# EAGLE design multiple_LED (EAGLE 7.3.0)
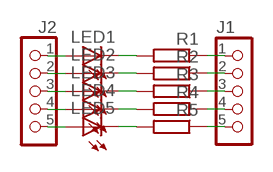
[diagram p0: schematic, sheet 1]

## Parts
J1  CON_HEADER_1X05-PTH  [M1X5]
J2  CON_HEADER_1X05-PTH  [M1X5]
LED1  LED-0805  [LED-805]
LED2  LED-0805  [LED-805]
LED3  LED-0805  [LED-805]
LED4  LED-0805  [LED-805]
LED5  LED-0805  [LED-805]
R1  RESISTOR-0603  [R603]
R2  RESISTOR-0603  [R603]
R3  RESISTOR-0603  [R603]
R4  RESISTOR-0603  [R603]
R5  RESISTOR-0603  [R603]

## Nets
IN: J2.1 LED1.A
IN1: J2.2 LED2.A
IN2: J2.3 LED3.A
IN3: J2.4 LED4.A
IN4: J2.5 LED5.A
N$1: LED2.C R2.2
N$2: LED1.C R1.2
N$3: LED3.C R3.2
N$4: LED4.C R4.2
N$5: LED5.C R5.2
OUT: J1.1 R1.1
OUT1: J1.2 R2.1
OUT2: J1.3 R3.1
OUT3: J1.4 R4.1
OUT4: J1.5 R5.1

## Library data of the parts
J1 J2 = dp_devices:CON_HEADER_1X05
LED1-LED5 = dp_devices:LED: Light Emitting Diode
R1-R5 = dp_devices:RESISTOR

## Board
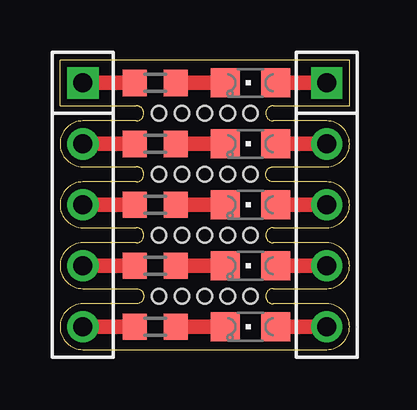
[diagram p1: board, top side]

Size 12.37 x 12.06 mm. Coordinates in mm from the lower left corner, seen from the top.
Outline: 12.37,0.94 12.37,0.95
Outline: 0.95,0 11.11,0 arc180 11.11,1.91 8.89,1.91 arc-180 8.89,2.54 11.11,2.54 arc180 11.11,4.45 8.89,4.45 arc-180 8.89,5.08 11.11,5.08 arc180 11.11,6.99 8.89,6.99 arc-180 8.89,7.62 11.11,7.62 arc180 11.11,9.52 8.89,9.52 arc-180 8.89,10.16 12.07,10.16 12.07,12.07 0,12.07 0,10.16 3.18,10.16 arc-180 3.18,9.52 0.95,9.52 arc180 0.95,7.62 3.18,7.62 arc-180 3.18,6.99 0.95,6.99 arc180 0.95,5.08 3.18,5.08 arc-180 3.18,4.45 0.95,4.45 arc180 0.95,2.54 3.18,2.54 arc-180 3.18,1.91 0.95,1.91 arc180 0.95,0
Copper layers (1*16): Top 0.035mm / dielectric 1.5mm / Bottom 0.035mm
Design rules "dirt_cheap_dirty_boards.v1": minimum track width 5mil, minimum drill 12mil, track to track 5mil, track to pad 5mil, pad to pad 5mil, via to via 5mil, smd to smd 0mil, copper to edge 10mil, drill to drill 10mil, minimum pad ring 10mil, minimum via ring 6mil, stop-mask expansion 2mil, vias tented up to drill 25mil, thermal gap 10mil
Holes 0.6 mm at 6.03,9.84 5.08,9.84 6.99,9.84 7.94,9.84 4.13,9.84 6.03,7.3 5.08,7.3 6.99,7.3 7.94,7.3 4.13,7.3 6.03,4.76 5.08,4.76 6.99,4.76 7.94,4.76 4.13,4.76 6.03,2.22 5.08,2.22 6.99,2.22 7.94,2.22 4.13,2.22

### Footprints (pad centres in the part's own frame; a part is rotated, then mirrored left to right if it is on the bottom)
M1X5 = drill 0.8 square: 1 -5.08,0 | drill 0.8: 2 -2.54,0; 3 0,0; 4 2.54,0; 5 5.08,0
LED-805 = smd 1.2 x 1.2: A 0,-1.05; C 0,1.05
R603 = smd 1 x 1.1: 1 -0.85,0; 2 0.85,0

### Placement (x,y rotation side)
J1  0.95,6.03 270 top
J2  11.11,6.03 270 top
LED1  7.94,11.11 90 top
LED2  7.94,8.57 90 top
LED3  7.94,6.03 90 top
LED4  7.94,3.49 90 top
LED5  7.94,0.95 90 top
R1  3.97,11.11 0 top
R2  3.97,8.57 0 top
R3  3.97,6.03 0 top
R4  3.97,3.49 0 top
R5  3.97,0.95 0 top

### Tracks (layer width: path | path; a pad name or v marks a point on that pad's centre or on a via)
IN
  Top 0.61: LED1.A J2.1
IN1
  Top 0.61: J2.2 LED2.A
IN2
  Top 0.61: LED3.A J2.3
IN3
  Top 0.61: J2.4 LED4.A
IN4
  Top 0.61: LED5.A J2.5
N$1
  Top 0.61: LED2.C R2.2
N$2
  Top 0.61: R1.2 LED1.C
N$3
  Top 0.61: R3.2 LED3.C
N$4
  Top 0.61: LED4.C R4.2
N$5
  Top 0.61: R5.2 LED5.C
OUT
  Top 0.61: J1.1 R1.1
OUT1
  Top 0.61: R2.1 J1.2
OUT2
  Top 0.61: J1.3 R3.1
OUT3
  Top 0.61: R4.1 J1.4
OUT4
  Top 0.61: J1.5 R5.1